# Altium schematic sheet nrf52832_ciaa_2-layer.SchDoc: nRF52832-CIAA Reference Layout (2-Layers)
size A4; Revision: 1.0; SheetNumber: 1; SheetTotal: 1; DrawnBy: RUBR; DocumentSize: A4; PCAName: nRF52832-CIAA Reference Layout (2-Layers)
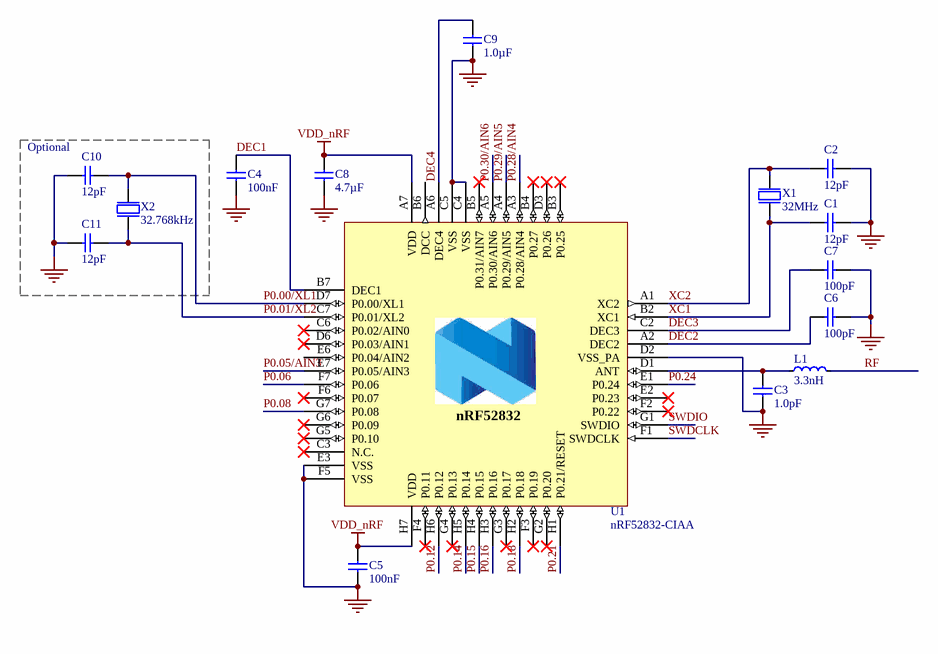
[diagram p0: nrf52832_ciaa_2-layer.SchDoc]

## Parts
C1  12pF  [CAPC0603X03L]
C2  12pF  [CAPC0603X03L]
C3  1.0pF  [CAPC0603X03L]
C4  100nF  [CAPC0603X03L]
C5  100nF  [CAPC0603X03L]
C6  100pF  [CAPC0603X03L]
C7  100pF  [CAPC0603X03L]
C8  4.7µF  [CAPC1608X06L]
C9  1.0µF  [CAPC1005X04L]
C10  12pF  [CAPC0603X03L]
C11  12pF  [CAPC0603X03L]
L1  3.3nH  [INDC0603X03L]
U1  nRF52832-CIAA  [BGA50C40P7X8_295X322X50]
X1  32MHz  [BT-XTAL_2016]
X2  32.768kHz  [XTAL_2012]

## Blocks framed on the sheet
Optional: C10 C11 X2

## Nets
GND: C1.1 C2.1 C3.1 C4.2 C5.2 C6.1 C7.2 C8.2 C9.1 C10.1 C11.1 U1.C4(VSS) U1.C5(VSS) U1.D2(VSS_PA) U1.E3(VSS) U1.F5(VSS) X1.2(GND) X1.4(GND)
VDD_nRF: C5.1 C8.1 U1.A7(VDD) U1.H7(VDD)
DEC1: C4.1 U1.B7(DEC1)
DEC2: C6.2 U1.A2(DEC2)
DEC3: C7.1 U1.C2(DEC3)
DEC4: C9.2 U1.A6(DEC4)
P0.00/XL1: C10.2 U1.D7(P0.00/XL1) X2.1(inp)
P0.01/XL2: C11.2 U1.C7(P0.01/XL2) X2.2(out)
P0.05/AIN3: U1.E7(P0.05/AIN3)
P0.06: U1.F7(P0.06)
P0.08: U1.G7(P0.08)
P0.12: U1.H6(P0.12)
P0.14: U1.H5(P0.14)
P0.15: U1.H4(P0.15)
P0.16: U1.H3(P0.16)
P0.18: U1.H2(P0.18)
P0.21: U1.H1(P0.21/RESET)
P0.24: U1.E1(P0.24)
P0.28/AIN4: U1.A3(P0.28/AIN4)
P0.29/AIN5: U1.A4(P0.29/AIN5)
P0.30/AIN6: U1.A5(P0.30/AIN6)
RF: L1.2
SWDCLK: U1.F1(SWDCLK)
SWDIO: U1.G1(SWDIO)
XC1: C1.2 U1.B2(XC1) X1.1(inp)
XC2: C2.2 U1.A1(XC2) X1.3(out)
NetC3_2: C3.2 L1.1 U1.D1(ANT)

Not connected (* = marked no-connect by the designer): U1 B3(P0.25)* B4(P0.27)* B5(P0.31/AIN7)* B6(DCC) C3(N.C.)* C6(P0.02/AIN0)* D3(P0.26)* D6(P0.03/AIN1)* E2(P0.23)* E6(P0.04/AIN2) F2(P0.22)* F3(P0.19)* F4(P0.11)* F6(P0.07)* G2(P0.20)* G3(P0.17)* G4(P0.13)* G5(P0.10)* G6(P0.09)*

## Notes on the sheet
- Title
- Size
- Date:
- Project Number
- Sheet         of
- Revision
- File:
- Drawn By:
- (in symbol nRF52832-CIAA) nRF52832

## Library data of the parts
C1 C2 C10 C11 = C0201-12p: Capacitor, NP0, ±2%; Note: 50V; Artikkelnr Noca: N.A.; Part Number: C0201-12p; Manufacturer: *; Manufacturer Part Number: *; Datasheet: *; LatestRevisionDate: 2014-11-13; Pin Count: 2; Publisher: Nordic Semiconductor; Published: 2014-11-13; Value: 12pF; Supplier: *; Supplier part number: *; 2nd source Supplier: *; 2nd source part number: *; Footprint Doc: 0201; Artikkelnr Simpro: N.A.
C3 = C0201-1.0p: Capacitor, NP0, ±5%; Note: Chip Cap 1%; Artikkelnr Noca: N.A.; Part Number: C0201-1.0p; Manufacturer: *; Manufacturer Part Number: *; Datasheet: *; LatestRevisionDate: 2014-11-13; Pin Count: 2; Publisher: Nordic Semiconductor; Published: 2014-11-13; Value: 1.0pF; Supplier: *; Supplier part number: *; 2nd source Supplier: *; 2nd source part number: *; Footprint Doc: 0201; Artikkelnr Simpro: N.A.
C4 C5 = C0201-100n: Capacitor, X7R, ±10%; Note: 16V; Artikkelnr Noca: N.A.; Part Number: C0201-100n; Manufacturer: *; Manufacturer Part Number: *; Datasheet: *; LatestRevisionDate: 2014-11-13; Pin Count: 2; Publisher: Nordic Semiconductor; Published: 2014-11-13; Value: 100nF; Supplier: *; Supplier part number: *; 2nd source Supplier: *; 2nd source part number: *; Footprint Doc: 0201; Artikkelnr Simpro: N.A.
C6 C7 = C0201-100p: Capacitor, NP0, ±5%; Note: Chip Cap 1%; Artikkelnr Noca: N.A.; Part Number: C0201-100p; Manufacturer: *; Manufacturer Part Number: *; Datasheet: *; LatestRevisionDate: 2014-11-13; Pin Count: 2; Publisher: Nordic Semiconductor; Published: 2014-11-13; Value: 100pF; Supplier: *; Supplier part number: *; 2nd source Supplier: *; 2nd source part number: *; Footprint Doc: 0201; Artikkelnr Simpro: N.A.
C8 = C0603-4µ7: Capacitor, X5R, ±10%; Note: 6.3V; Artikkelnr Noca: 20069060; Artikkelnr Simpro: N.A.; Part Number: C0603-4µ7; Manufacturer: *; Manufacturer Part Number: *; Datasheet: *; LatestRevisionDate: 2009-11-23; Pin Count: 2; Publisher: Nordic Semiconductor; Published: 2009-05-08; Value: 4.7µF; Supplier: *; Supplier part number: *; 2nd source Supplier: *; 2nd source part number: *; Footprint Doc: 0603
C9 = C0402-1µ0: Capacitor, X5R, ±5%; Note: 6.3V; Artikkelnr Noca: 20039235; Artikkelnr Simpro: N.A.; Part Number: C0402-1µ0; Manufacturer: *; Manufacturer Part Number: *; Datasheet: *; LatestRevisionDate: 2009-11-23; Pin Count: 2; Publisher: Nordic Semiconductor; Published: 2009-05-08; Value: 1.0µF; Supplier: *; Supplier part number: *; 2nd source Supplier: *; 2nd source part number: *; Footprint Doc: 0402
L1 = L0201-3n3: High frequency chip inductor ±5%; Artikkelnr Noca: N.A.; Part Number: L0201-3n3; Manufacturer: *; Manufacturer Part Number: *; Datasheet: *; LatestRevisionDate: 2013-04-10; Pin Count: 2; Publisher: Nordic Semiconductor; Published: 2013-04-10; Value: 3.3nH; Note: High frequency chip inductor ±5%; Supplier: *; Supplier part number: *; 2nd source Supplier: *; 2nd source part number: *; Footprint Doc: 0201; Artikkelnr Simpro: N.A.
U1 = nRF52832-CIAA: Multi-protocol Bluetooth Low Energy, ANT and 2.4GHz proprietary system-on-chip; Manufacturer: Nordic Semiconductor; Artikkelnr Noca: N.A.; Part Number: nRF52832-CIAA; Manufacturer Part Number: nRF52832-CIAA; Datasheet: *; LatestRevisionDate: 2016-03-11; Pin Count: 54; Publisher: Nordic Semiconductor; Published: 2016-03-11; Value: nRF52832-CIAA; Note: *; Supplier: Nordic Semiconductor; Supplier part number: *; 2nd source Supplier: *; 2nd source part number: *; Footprint Doc: WLCSP_C50; Artikkelnr Simpro: N.A.; Part number IPS: N.A.
X1 = XTAL_SMD2016_32MHz_8pF_Epson: XTAL SMD 2016, 32MHz, Cl=8pF, Total Tol: ±40ppm; Manufacturer: Epson Toyocom; Manufacturer Part Number: Q22FA12800025; Note: XTAL SMD 32.000MHz; Artikkelnr Noca: N.A.; Part Number: XTAL_SMD2016_32MHz_8pF_Epson; Datasheet: http://www.epsondevice.com/docs/qd/en/DownloadServlet?id=ID000449; LatestRevisionDate: 2014-11-27; Pin Count: 4; Publisher: Nordic Semiconductor; Published: 2012-03-09; Value: 32MHz; Supplier: Farnell; Supplier part number: 171-2806; 2nd source Supplier: *; 2nd source part number: *; Footprint Doc: XTAL_2016; Artikkelnr Simpro: N.A.
X2 = XTAL_SMD2012_32.768kHz_9pF_Seiko: XTAL SMD 2012, 32.768kHz, Cl=9pF, Total Tol: ±50ppm; Manufacturer: Seiko; Manufacturer Part Number: SC20S-9.0PF20PPM; Note: XTAL SMD 32.768kHz, 2012; Artikkelnr Noca: N.A.; Part Number: XTAL_SMD2012_32.768kHz_9pF_Seiko; Datasheet: http://www.sii.co.jp/en/quartz/files/2013/03/file_PRODUCT_MASTER_50811_GRAPHIC03.pdf; LatestRevisionDate: 2015-10-15; Pin Count: 2; Publisher: Nordic Semiconductor; Published: 2015-10-15; Value: 32.768kHz; Supplier: *; Supplier part number: *; 2nd source Supplier: *; 2nd source part number: *; Footprint Doc: XTAL_2012; Artikkelnr Simpro: N.A.